# Altium schematic sheet Connectors.SchDoc
size A4; SheetNumber: 2; SheetTotal: 2
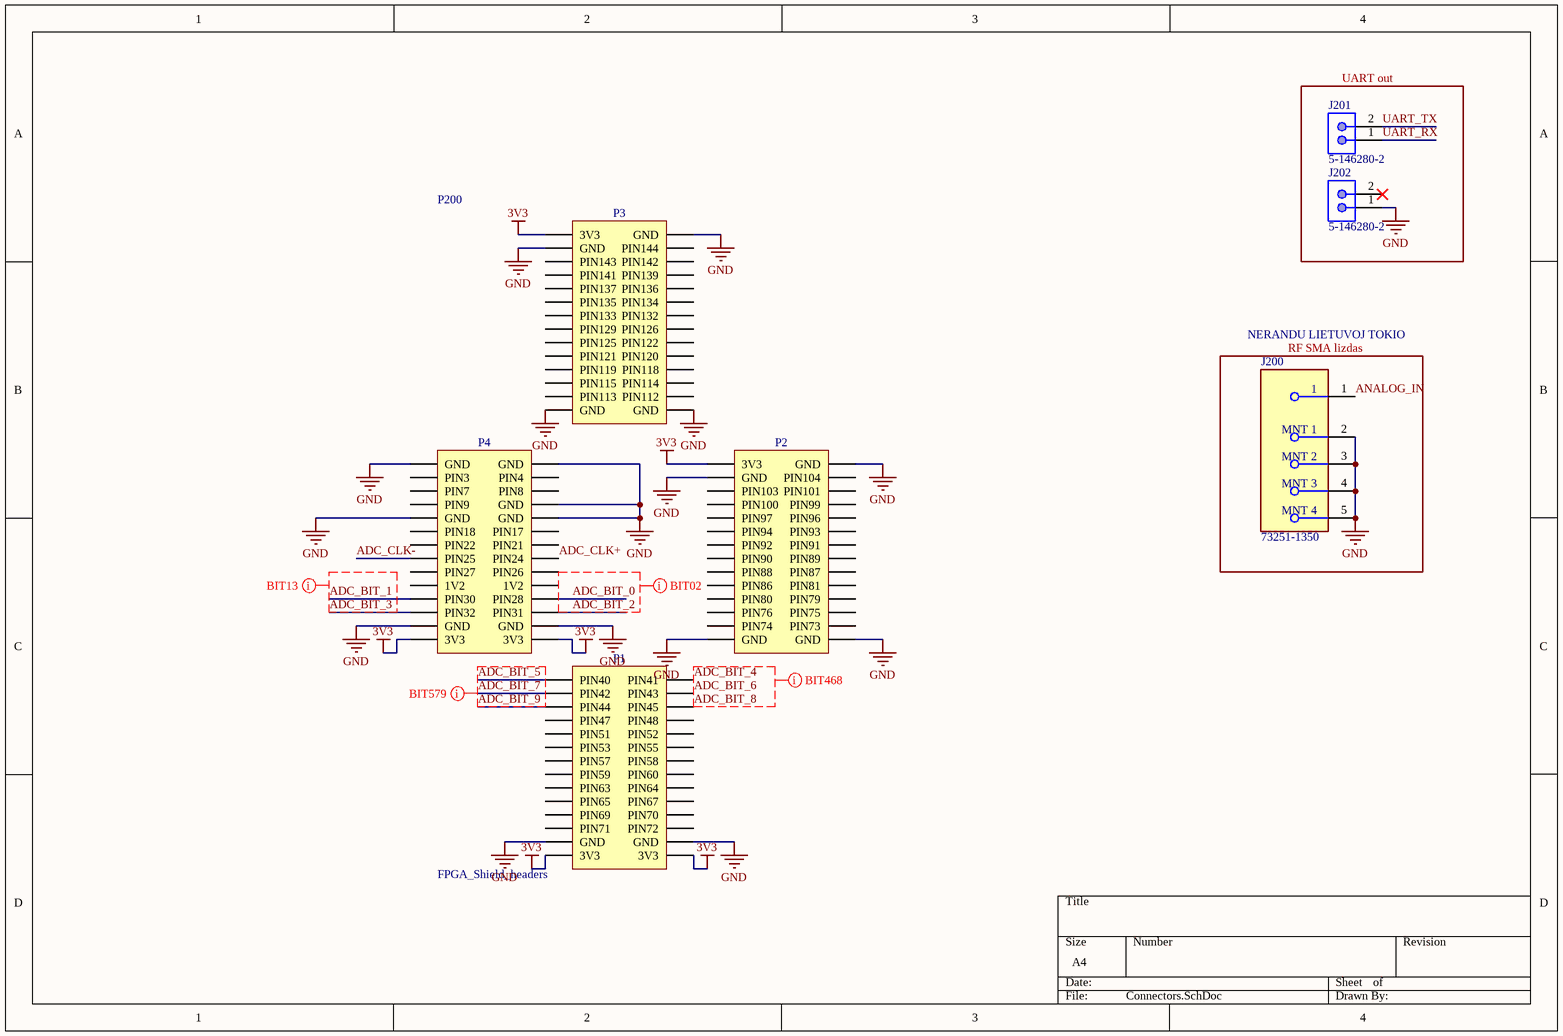
[diagram p0: Connectors.SchDoc]

## Parts
J200  73251-1350  [FP-73251-1350-MFG]
J201  5-146280-2  [TECO-5-146280-2_V]
J202  5-146280-2  [TECO-5-146280-2_V]
P200  FPGA_Shield_headers  [FPGA_SHIELD_HEADER_FOOTPRINT]

## Blocks framed on the sheet
UART out: J201 J202

## Nets
3V3: P200.27(3V3) P200.28(3V3) P200.29(3V3) P200.57(3V3) P200.111(3V3) P200.112(3V3)
GND: J200.2(MNT_1) J200.3(MNT_2) J200.4(MNT_3) J200.5(MNT_4) J202.1 P200.1(GND) P200.2(GND) P200.8(GND) P200.9(GND) P200.10(GND) P200.25(GND) P200.26(GND) P200.30(GND) P200.31(GND) P200.55(GND) P200.56(GND) P200.58(GND) P200.59(GND) P200.83(GND) P200.84(GND) P200.109(GND) P200.110(GND)
ADC_BIT_0: P200.22(PIN28)
ADC_BIT_1: P200.21(PIN30)
ADC_BIT_2: P200.24(PIN31)
ADC_BIT_3: P200.23(PIN32)
ADC_BIT_4: P200.86(PIN41)
ADC_BIT_5: P200.85(PIN40)
ADC_BIT_6: P200.88(PIN43)
ADC_BIT_7: P200.87(PIN42)
ADC_BIT_8: P200.90(PIN45)
ADC_BIT_9: P200.89(PIN44)
ADC_CLK+: P200.16(PIN24)
ADC_CLK-: P200.15(PIN25)
ANALOG_IN: J200.1
UART_RX: J201.1
UART_TX: J201.2

Not connected (* = marked no-connect by the designer): J202 2*; P200 3(PIN3) 4(PIN4) 5(PIN7) 6(PIN8) 7(PIN9) 11(PIN18) 12(PIN17) 13(PIN22) 14(PIN21) 17(PIN27) 18(PIN26) 19(1V2) 20(1V2) 32(PIN144) 33(PIN143) 34(PIN142) 35(PIN141) 36(PIN139) 37(PIN137) 38(PIN136) 39(PIN135) 40(PIN134) 41(PIN133) 42(PIN132) 43(PIN129) 44(PIN126) 45(PIN125) 46(PIN122) 47(PIN121) 48(PIN120) 49(PIN119) 50(PIN118) 51(PIN115) 52(PIN114) 53(PIN113) 54(PIN112) 60(PIN104) 61(PIN103) 62(PIN101) 63(PIN100) 64(PIN99) 65(PIN97) 66(PIN96) 67(PIN94) 68(PIN93) 69(PIN92) 70(PIN91) 71(PIN90) 72(PIN89) 73(PIN88) 74(PIN87) 75(PIN86) 76(PIN81) 77(PIN80) 78(PIN79) 79(PIN76) 80(PIN75) 81(PIN74) 82(PIN73) 91(PIN47) 92(PIN48) 93(PIN51) 94(PIN52) 95(PIN53) 96(PIN55) 97(PIN57) 98(PIN58) 99(PIN59) 100(PIN60) 101(PIN63) 102(PIN64) 103(PIN65) 104(PIN67) 105(PIN69) 106(PIN70) 107(PIN71) 108(PIN72)

## Layout directives
net class BIT468: ADC_BIT_4, ADC_BIT_6, ADC_BIT_8
net class BIT579: ADC_BIT_7
net class BIT13: ADC_BIT_1, ADC_BIT_3
net class BIT02: ADC_BIT_0, ADC_BIT_2

## Notes on the sheet
- NERANDU LIETUVOJ TOKIO
- (near J200) RF SMA lizdas
- (in symbol FPGA_Shield_headers) P3; P4; P2; P1

## Library data of the parts
J200 = CMP-04764-000006-1: CONN SMA JACK STR 50 OHM SMD; Manufacturer: Molex; Is Female: yes; Standoff Height: 0.41mm; Impedance: 50Ω; Number Of Contacts: 1; Conn Orientation: Straight; Voltage Rating: 500V; Shielding: true; Frequency: 18GHz; Package: 73251-1350; Device Class L1: Connectors; Category: Conn; Manufacturer Part Number: 73251-1350; ComponentLink2URL: https://www.molex.com/pdm_docs/sd/732511350_sd.pdf; Automotive: No; Height: 9.655mm; Octopart: https://octopart.com/73251-1350-molex-5414390; Footprint Url: https://forum.upverter.com/uploads/default/original/3X/d/a/daeafa2ce4908d4fc4e49f0b17d7d2c986fce444.pdf; Temperature Range High: +165°C; Device Class L3: unset; Mouser Description: RF Connectors / Coaxial Connectors SMA ST PCB-JCK STD SMT; Lead Free: Yes; Temperature: -65°C to +165°C; RoHS: TRUE; ComponentLink2Description: Datasheet; Device Class L2: RF / Coaxial Connectors; Digikey Description: CONN SMA JACK STR 50 OHM SMD; Contact Material: Gold; Temperature Range Low: -65°C
J201 J202 = CMP-2000-07492-1: Male Header, Pitch 2.54 mm, 1 x 2 Position, Height 8.21 mm, Tail Length 3.05 mm, -65 to 105 degC, RoHS, Bulk; Manufacturer: TE Connectivity; Mating Connector Lock: No(Without); Number of Positions: 2; Pitch: 2.54mm; PCB Mounting Orientation: Vertical; Keyed: No; Case\/Package: 100; Mating Post Length: 0.23inch; High Temperature Housing: Yes; Max Current Rating: 5A; PCB Thickness: 0.063inch; PCB Mount Retention: Without; Approvals: CSA; Current Rating: 3A; Radiation Hardening: No; Length: 4.67mm; Contact Mating Length: 0.23inch; Connector Type: Header; Number of Rows: 1; Termination Post Length: 0.12inch; Board Standoff: No(Without); Max Operating Temperature: 105degC; Contact Shape: Square; Selectively Loaded: No(Without); Gasket: No(Without); Number of Contacts: 2; Contact Gender: Male; Mating Alignment: No(Without); Manufacturer URL: http://www.te.com/; Datasheet URL: http://www.te.com/commerce/DocumentDelivery/DDEController?Action=showdoc&DocId=Customer+Drawing%7F146280%7FH1%7Fpdf%7FEnglish%7FENG_CD_146280_H1.pdf%7F5-146280-2; Mount: ThroughHole; Orientation: Straight; Packaging: Carton; Package Reference: 5-146280-2; Package Quantity: 500; Stabilizers: No(Without); Row Spacing: 2.54mm; Contact Material: CopperAlloy; Panel Mount Retention: No(Without); Datasheet Version: Rev. H1, 08/2016; Housing Colour: Black; Colour: Black; Package Description: Male Header, Pitch 2.54 mm, 1 x 2 Position, Height 8.21 mm, Tail Length 3.05 mm; Contact Plating: Matte; Housing Material: Polymer; Contact Protection: No(Without); Min Operating Temperature: -65degC; Mounting Technology: ThroughHole; Flammability Rating: UL94V-0; RoHSCompliant: true; Termination: ThroughHole; Depth: 2.34mm; High Speed Serial Data Connector: No